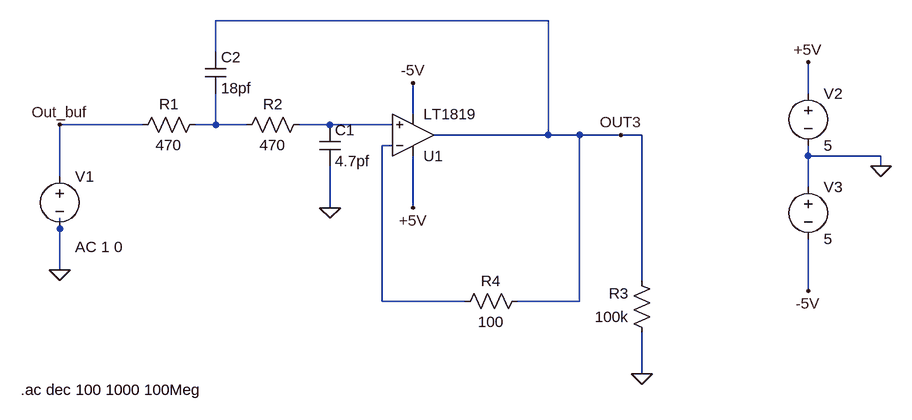
[diagram p0: schematic TEST_LPF.asc]
TEST_LPF.asc, the LTspice schematic file:
Version 4
SHEET 1 948 680
WIRE 416 -112 -96 -112
WIRE -96 -64 -96 -112
WIRE 816 0 816 -48
WIRE 208 32 208 -16
WIRE -208 48 -336 48
WIRE -96 48 -96 0
WIRE -96 48 -128 48
WIRE -48 48 -96 48
WIRE 80 48 32 48
WIRE 176 48 80 48
WIRE 416 64 416 -112
WIRE 416 64 240 64
WIRE 464 64 416 64
WIRE 528 64 464 64
WIRE 560 64 528 64
WIRE 176 80 160 80
WIRE 816 96 816 80
WIRE 928 96 816 96
WIRE 928 112 928 96
WIRE -336 128 -336 48
WIRE 816 144 816 96
WIRE 80 176 80 112
WIRE 208 176 208 96
WIRE -336 208 -336 192
WIRE -336 272 -336 208
WIRE 560 288 560 64
WIRE 816 304 816 224
WIRE 160 320 160 80
WIRE 288 320 160 320
WIRE 464 320 464 64
WIRE 464 320 368 320
WIRE 560 432 560 368
FLAG -336 272 0
FLAG 80 176 0
FLAG 560 432 0
FLAG 208 -16 -5V
FLAG 208 176 +5V
FLAG 528 64 OUT3
FLAG -336 48 Out_buf
FLAG 928 112 0
FLAG 816 -48 +5V
FLAG 816 304 -5V
SYMBOL voltage -336 112 R0
WINDOW 123 24 124 Left 2
WINDOW 39 0 0 Left 2
SYMATTR Value2 AC 1 0
SYMATTR InstName V1
SYMATTR Value ""
SYMBOL res -112 32 R90
WINDOW 0 0 56 VBottom 2
WINDOW 3 32 56 VTop 2
SYMATTR InstName R1
SYMATTR Value 470
SYMBOL res 48 32 R90
WINDOW 0 0 56 VBottom 2
WINDOW 3 32 56 VTop 2
SYMATTR InstName R2
SYMATTR Value 470
SYMBOL res 576 384 R180
WINDOW 0 36 76 Left 2
WINDOW 3 36 40 Left 2
SYMATTR InstName R3
SYMATTR Value 100k
SYMBOL res 272 336 R270
WINDOW 0 32 56 VTop 2
WINDOW 3 0 56 VBottom 2
SYMATTR InstName R4
SYMATTR Value 100
SYMBOL Opamps\\LT1819 208 64 M180
SYMATTR InstName U1
SYMBOL cap 64 48 R0
SYMATTR InstName C1
SYMATTR Value 4.7pf
SYMBOL cap -112 -64 R0
SYMATTR InstName C2
SYMATTR Value 18pf
SYMBOL voltage 816 -16 R0
WINDOW 123 0 0 Left 2
WINDOW 39 0 0 Left 2
SYMATTR InstName V2
SYMATTR Value 5
SYMBOL voltage 816 128 R0
WINDOW 123 0 0 Left 2
WINDOW 39 0 0 Left 2
SYMATTR InstName V3
SYMATTR Value 5
TEXT -396 456 Left 2 !.ac dec 100 1000 100Meg

The netlist it stands for:
* TEST_LPF.asc
V1 Out_buf 0 AC 1 0
R1 N001 Out_buf 470
R2 N002 N001 470
R3 0 OUT3 100k
R4 N003 OUT3 100
* U1: LT1819 (symbol Opamps\LT1819 not available, pins judged from their places): In+=N002 In-=N003 V+=+5V V-=-5V OUT=OUT3
C1 N002 0 4.7pf
C2 OUT3 N001 18pf
V2 +5V 0 5
V3 0 -5V 5
.ac dec 100 1000 100Meg
.backanno
.end